# EAGLE design Led_Circle (EAGLE 7.2.0)
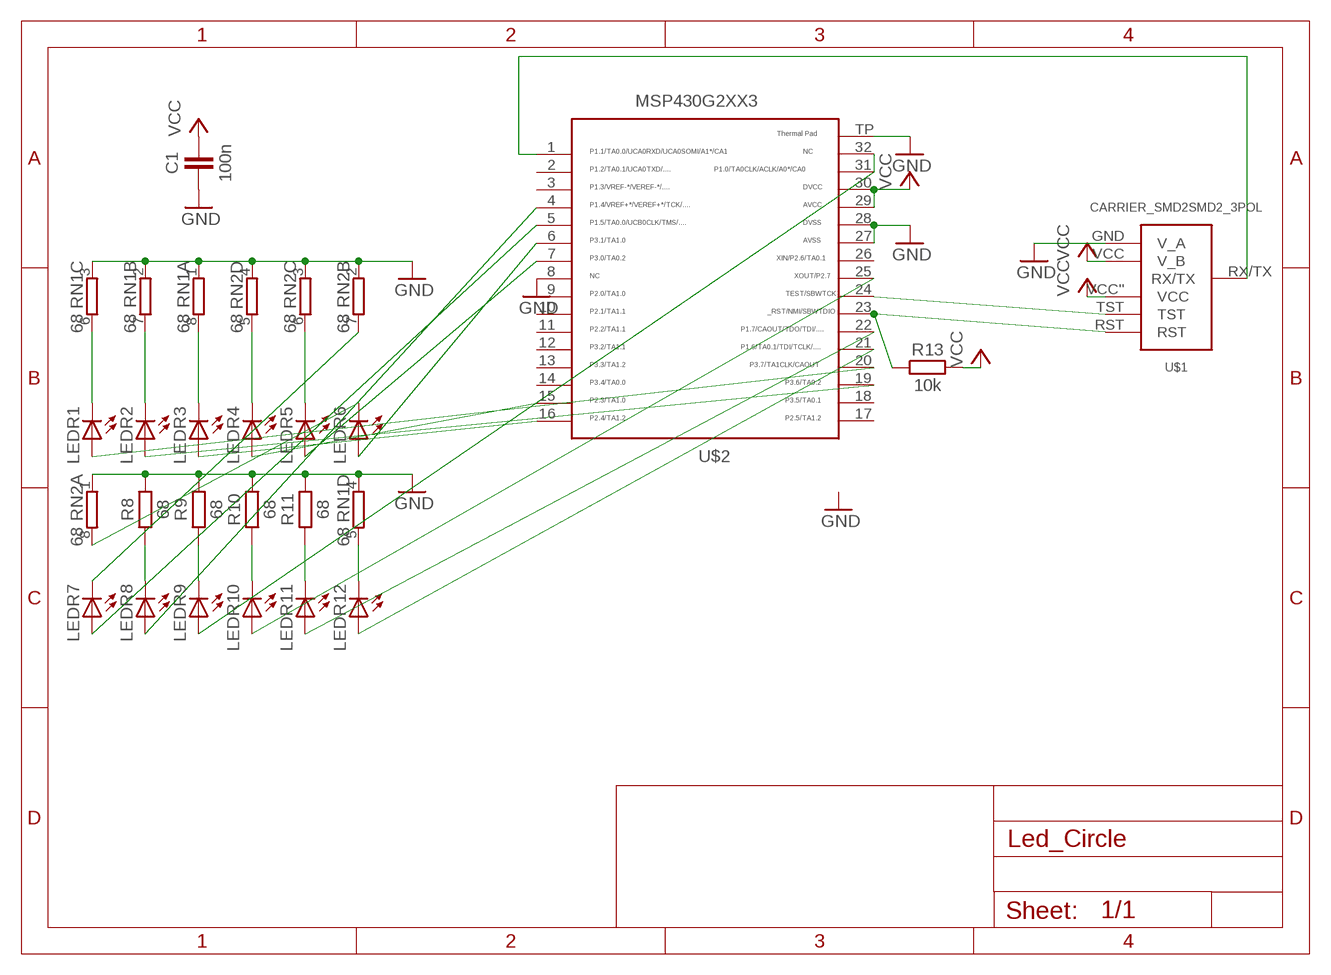
[diagram p0: schematic, sheet 1]

## Parts
C1  100n  CAPACITOR  [603]
LEDR1  LEDCHIPLED_0603  [CHIPLED_0603]
LEDR2  LEDCHIPLED_0603  [CHIPLED_0603]
LEDR3  LEDCHIPLED_0603  [CHIPLED_0603]
LEDR4  LEDCHIPLED_0603  [CHIPLED_0603]
LEDR5  LEDCHIPLED_0603  [CHIPLED_0603]
LEDR6  LEDCHIPLED_0603  [CHIPLED_0603]
LEDR7  LEDCHIPLED_0603  [CHIPLED_0603]
LEDR8  LEDCHIPLED_0603  [CHIPLED_0603]
LEDR9  LEDCHIPLED_0603  [CHIPLED_0603]
LEDR10  LEDCHIPLED_0603  [CHIPLED_0603]
LEDR11  LEDCHIPLED_0603  [CHIPLED_0603]
LEDR12  LEDCHIPLED_0603  [CHIPLED_0603]
R8  68  RESISTOR0603  [603]
R9  68  RESISTOR0603  [603]
R10  68  RESISTOR0603  [603]
R11  68  RESISTOR0603  [603]
R13  10k  RESISTOR0603  [603]
RN1  68  4R-N0603-ARC  [0603-ARC]
RN2  68  4R-N0603-ARC  [0603-ARC]
U$1  CARRIER_SMD2SMD2_3POL  [CARRIER_SMD2_3POL]
U$2  MSP430G2553  [QFN32]

## Nets
GND: C1.1 R8.2 R9.2 R10.2 R11.2 RN1.1 RN1.2 RN1.3 RN1.4 RN2.1 RN2.2 RN2.3 RN2.4 U$1.GND(V_A) U$2.8 U$2.27 U$2.28 U$2.TP
N$1: LEDR8.A U$2.4
N$2: LEDR7.C RN2.7
N$3: U$1.RX/TX U$2.1
N$4: LEDR12.C RN1.5
N$5: LEDR11.C R11.1
N$6: LEDR10.C R10.1
N$7: LEDR9.C R9.1
N$11: LEDR8.C R8.1
N$12: LEDR6.C RN2.8
N$14: LEDR5.C RN2.6
N$15: LEDR4.C RN2.5
N$16: LEDR3.C RN1.8
N$17: LEDR2.C RN1.7
N$18: LEDR1.C RN1.6
N$19: LEDR9.A U$2.31 U$2.32
N$21: LEDR10.A U$2.25
N$22: LEDR11.A U$2.22
N$23: LEDR12.A U$2.21
N$24: LEDR1.A U$2.20
N$25: LEDR2.A U$2.19
N$26: LEDR3.A U$2.16
N$27: LEDR4.A U$2.15
N$28: LEDR5.A U$2.7
N$29: LEDR6.A U$2.6
N$32: LEDR7.A U$2.5
RST: R13.1 U$1.RST U$2.23
TST: U$1.TST U$2.24
VCC: C1.2 R13.2 U$1.VCC''(VCC) U$1.VCC(V_B) U$2.29 U$2.30
Unconnected: U$2.2 U$2.3 U$2.9 U$2.10 U$2.11 U$2.12 U$2.13 U$2.14 U$2.17 U$2.18 U$2.26

## Library data of the parts
C1 = thar:CAPACITOR
LEDR1-LEDR12 = led:LED: LED OSRAM: - CHIPLED LG R971, LG N971, LY N971, LG Q971, LY Q971, LO R971, LY R971 LH N974, LH R974 LS Q976, LO Q976, LY Q976 LO Q996 - Hyper CHIPLED LW Q18S LB Q993, LB Q99A, LB R99A - SideLED LS A670, LO A670, LY A670, LG A670, LP A670 LB A673, LV A673, LT A673, LW A673 LH A674 LY A675 LS A676, LA A676, LO A676, LY A676, LW A676 LS A679, LY A679, LG A679 - Hyper Micro SIDELED® LS Y876, LA Y876, LO Y876, LY Y876 LT Y87S - SmartLED LW L88C, LW L88S LB L89C, LB L89S, LG L890 LS L89K, LO L89K, LY L89K LS L896, LA L896, LO L896, LY L896 - TOPLED LS T670, LO T670, LY T670, LG T670, LP T670 LSG T670, LSP T670, LSY T670, LOP T670, LYG T670 LG T671, LOG T671, LSG T671 LB T673, LV T673, LT T673, LW T673 LH T674 LS T676, LA T676, LO T676, LY T676, LB T676, LH T676, LSB T676, LW T676 LB T67C, LV T67C, LT T67C, LS T67K, LO T67K, LY T67K, LW E67C LS E67B, LA E67B, LO E67B, LY E67B, LB E67C, LV E67C, LT E67C LW T67C LS T679, LY T679, LG T679 LS T770, LO T770, LY T770, LG T770, LP T770 LB T773, LV T773, LT T773, LW T773 LH T774 LS E675, LA E675, LY E675, LS T675 LS T776, LA T776, LO T776, LY T776, LB T776 LHGB T686 LT T68C, LB T68C - Hyper Mini TOPLED® LB M676 - Mini TOPLED Santana® LG M470 LS M47K, LO M47K, LY M47K Source: http://www.osram.convergy.de LUXEON: - LUMILED® LXK2-PW12-R00, LXK2-PW12-S00, LXK2-PW14-U00, LXK2-PW14-V00 LXK2-PM12-R00, LXK2-PM12-S00, LXK2-PM14-U00 LXK2-PE12-Q00, LXK2-PE12-R00, LXK2-PE12-S00, LXK2-PE14-T00, LXK2-PE14-U00 LXK2-PB12-K00, LXK2-PB12-L00, LXK2-PB12-M00, LXK2-PB14-N00, LXK2-PB14-P00, LXK2-PB14-Q00 LXK2-PR12-L00, LXK2-PR12-M00, LXK2-PR14-Q00, LXK2-PR14-R00 LXK2-PD12-Q00, LXK2-PD12-R00, LXK2-PD12-S00 LXK2-PH12-R00, LXK2-PH12-S00 LXK2-PL12-P00, LXK2-PL12-Q00, LXK2-PL12-R00 Source: www.luxeon.com KINGBRIGHT: KA-3528ASYC Source: www.kingbright.com
R8-R11 R13 = thar:RESISTOR
RN1 RN2 = resistor-dil:4R-N: Array Chip Resistor Source: RS Component / Phycomp; OC_FARNELL: unknown; OC_NEWARK: unknown
U$1 = thar:CARRIER_SMD2
U$2 = thar:MSP430G2553: TEXAS INSTRUMENTS MSP430G2553IRHB32R MCU, 16BIT, MSP430, 16MHZ, QFN-32 Farnell Best.Nr.: 2325726 Herst.Bez.: MSP430G2553IRHB32R

## Board
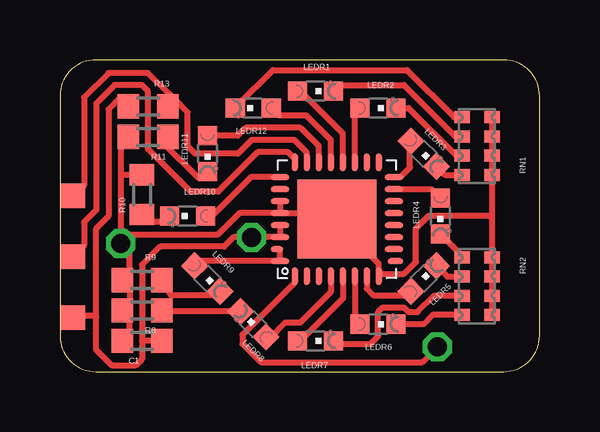
[diagram p1: board, top side]
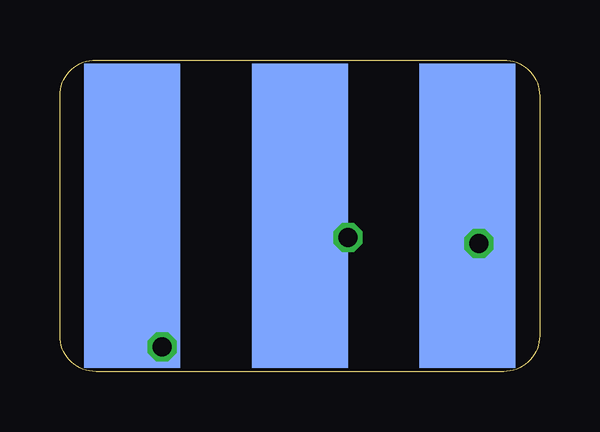
[diagram p2: board, bottom side, seen from below]

Size 20 x 13 mm. Coordinates in mm from the lower left corner, seen from the top.
Copper layers (1*16): Top 0.035mm / dielectric 1.5mm / Bottom 0.035mm
Design rules "Bilex DRU *": minimum track width 10mil, minimum drill 24mil, track to track 10mil, track to pad 10mil, pad to pad 10mil, via to via 10mil, smd to smd 10mil, copper to edge 1mil, drill to drill 8mil, minimum pad ring 10mil, minimum via ring 8mil, stop-mask expansion 4mil, vias tented up to drill 0mil, thermal gap 10mil

### Footprints (pad centres in the part's own frame; a part is rotated, then mirrored left to right if it is on the bottom)
603 = smd 0.889 x 1.016: 1 -0.826,0; 2 0.826,0
CHIPLED_0603 = smd 0.8 x 0.8: A 0,-0.75; C 0,0.75
0603-ARC = smd 0.5 x 0.65: 1 -1.2,-0.625; 2 -0.4,-0.625; 3 0.4,-0.625; 4 1.2,-0.625; 5 1.2,0.625; 6 0.4,0.625; 7 -0.4,0.625; 8 -1.2,0.625
CARRIER_SMD2_3POL = smd 4 x 12.7 bottom: GND -6.985,0; RX/TX 6.985,0; VCC 0,0 | smd 1.016 x 1.016: RST -9.461,0.826; TST -9.461,-1.714; VCC'' -9.461,-4.255
QFN32 = smd 0.762 x 0.254: 1 -2.375,1.75; 2 -2.375,1.25; 3 -2.375,0.75; 4 -2.375,0.25; 5 -2.375,-0.25; 6 -2.375,-0.75; 7 -2.375,-1.25; 8 -2.375,-1.75; 17 2.375,-1.75; 18 2.375,-1.25; 19 2.375,-0.75; 20 2.375,-0.25; 21 2.375,0.25; 22 2.375,0.75; 23 2.375,1.25; 24 2.375,1.75 | smd 0.254 x 0.635: 9 -1.75,-2.438 | smd 0.254 x 0.762: 10 -1.25,-2.375; 11 -0.75,-2.375; 12 -0.25,-2.375; 13 0.25,-2.375; 14 0.75,-2.375; 15 1.25,-2.375; 16 1.75,-2.375; 25 1.75,2.375; 26 1.25,2.375; 27 0.75,2.375; 28 0.25,2.375; 29 -0.25,2.375; 30 -0.75,2.375; 32 -1.75,2.375 | smd 0.254 x 0.508: 31 -1.25,2.5 | smd 3.302 x 3.302: TP 0,0

### Placement (x,y rotation side)
C1  3.42,1.28 0 top
LEDR1  10.66,11.69 270 top
LEDR2  13.27,11 270 top
LEDR3  15.17,9.09 225 top
LEDR4  15.87,6.49 180 top
LEDR5  15.17,3.88 315 top
LEDR6  13.27,1.98 270 top
LEDR7  10.66,1.28 270 top
LEDR8  8.06,1.98 45 top
LEDR9  6.15,3.88 225 top
LEDR10  5.33,6.49 90 top
LEDR11  6.15,9.09 180 top
LEDR12  8.06,11 90 top
R8  3.42,2.55 180 top
R9  3.42,3.82 180 top
R10  3.42,7.38 90 top
R11  3.68,9.79 180 top
R13  3.68,11.06 180 top
RN1  17.39,9.41 90 top
RN2  17.39,3.57 90 top
U$1  10,6.5 0 top
U$2  11.55,6.36 90 top

### Tracks (layer width: path | path; a pad name or v marks a point on that pad's centre or on a via)
GND  (via drill 0.8)
  Top 0.254: U$2.28 10.79,6.61 U$2.TP 12.31,5.73 12.19,5.6 13.3,4.48 U$2.8 13.43,4.07 14.34,4.07 14.85,4.58 14.85,5.98 15.36,6.49 17.9,6.49 | 18.03,6.49 18.03,5.03 18.02,5.02 RN2.4 RN2.3 RN2.2 RN2.1 | 18.03,6.49 17.9,6.49 | 2.91,5.73 2.79,5.73 2.53,5.98 2.53,8.14 | 2.91,5.73 6.6,5.73 7.48,6.61 U$2.28 | R11.2 2.84,10.03 2.78,10.03 2.53,9.79 2.53,8.14 | U$2.27 U$2.28 | RN1.4 RN1.3 RN1.2 RN1.1 18.02,6.5 | 18.02,6.5 18.03,6.49 | 18.02,6.5 17.89,6.5 17.9,6.49 | R10.2 2.6,8.2 2.53,8.14 | 2.91,5.34 2.91,3.57 2.79,3.57 2.79,3.44 2.91,3.44 2.91,2.3 | 2.91,5.34 2.91,5.73 | v2.53,5.34 2.91,5.34 | 2.91,2.3 R8.2 | C1.1 2.91,1.28 2.91,2.3
  Top 0.406: R9.2 2.79,3.57
  Bottom 0.254: 2,6.5 2.41,6.09 v2.53,5.34 3.02,5.57 U$1.GND
N$1
  Top 0.254: LEDR8.A 8.8,1.45 9.39,2.04 10.03,2.04 11.3,3.32 U$2.4
N$2
  Top 0.254: LEDR7.C 11.42,1.28 11.55,1.15 12.95,1.15 13.27,1.47 13.27,2.49 13.46,2.68 14.34,2.68 14.54,2.49 14.92,2.49 15.6,3.17 RN2.7
N$3  (via drill 0.8)
  Top 0.254: U$2.1 9.8,3.72 7.61,1.53 7.61,1.15 8.38,0.39 15.11,0.39 v15.74,1.03
  Bottom 0.254: U$1.RX/TX 16.98,2.27 v15.74,1.03
N$4
  Top 0.254: LEDR12.C 7.41,11.11 8.88,12.58 14.47,12.58 16.45,10.61 RN1.5
N$5
  Top 0.254: LEDR11.C 6.22,8.14 6.17,8.09 5.76,8.09 4.31,9.54 4.31,10.04 4.38,9.98 4.57,9.98 R11.1
N$6
  Top 0.254: LEDR10.C 4.58,6.37 4.44,6.23 3.74,6.23 R10.1
N$7
  Top 0.254: LEDR9.C 6.68,3.14 6.6,3.06 6.6,3.18 4.63,3.18 R9.1
N$11
  Top 0.254: LEDR8.C 4.46,2.51 R8.1
N$12
  Top 0.254: RN2.8 15.56,2.37 15.17,1.98 LEDR6.C
N$14
  Top 0.254: LEDR5.C 16.15,3.97 RN2.6
N$15
  Top 0.254: 15.87,5.85 LEDR4.C 16.77,4.84 RN2.5
N$16
  Top 0.254: LEDR3.C 16.05,8.21 RN1.8
N$17
  Top 0.254: LEDR2.C 14.54,11 16.52,9.01 RN1.7
N$18
  Top 0.254: LEDR1.C 11.54,11.81 11.55,11.95 14.34,11.95 16.48,9.81 RN1.6
N$19
  Top 0.254: U$2.31 9.18,5.11 U$2.32 5.82,4.61 LEDR9.A 5.66,4.45
N$21
  Top 0.254: U$2.25 7.97,8.11 6.34,6.49 LEDR10.A
N$22
  Top 0.254: LEDR11.A 7.41,9.84 7.74,10.17 10.03,10.17 10.8,9.4 U$2.22
N$23
  Top 0.254: U$2.21 11.3,9.66 10.28,10.68 9.13,10.68 LEDR12.A
N$24
  Top 0.254: U$2.20 11.8,9.92 10.03,11.69 LEDR1.A
N$25
  Top 0.254: U$2.19 12.3,11.04 LEDR2.A
N$26
  Top 0.254: U$2.16 14.19,8.11 14.6,8.52 14.6,9.58 LEDR3.A
N$27
  Top 0.254: U$2.15 15.5,7.61 LEDR4.A
N$28
  Top 0.254: U$2.7 12.8,3.46 13.07,3.18 14.47,3.18 LEDR5.A
N$29
  Top 0.254: U$2.6 12.3,2.07 LEDR6.A
N$32
  Top 0.254: U$2.5 11.81,3.05 10.03,1.28 LEDR7.A
RST
  Top 0.254: U$2.23 10.3,9.13 9.77,9.66 8,9.66 7.42,9.09 5.64,9.09 5.33,9.41 5.33,10.8 4.82,11.31 4.76,11.38 | 4.5,11.63 R13.1 4.5,11.38 4.76,11.38 | 4.76,11.38 4.5,11.63 | 4.5,11.63 3.68,12.46 2.03,12.46 1.01,11.44 1.01,7.76 0.58,7.33 U$1.RST
TST
  Top 0.254: U$2.24 9.8,8.87 9.52,9.15 8.25,9.15 6.6,7.5 5.45,7.5 3.68,9.28 3.68,11.69 3.42,11.95 2.28,11.95 1.52,11.19 1.52,6.74 1.01,6.23 1.01,5.26 U$1.TST
VCC  (via drill 0.8)
  Top 0.254: U$2.29 U$2.30 v8,5.61 | R13.2 2.79,11.44 2.53,11.44 2.03,10.93 2.03,6.49 1.52,5.98 1.52,2.3 | 1.52,2.3 1.52,0.9 2.15,0.26 3.17,0.26 3.42,0.52 3.42,1.28 | U$1.VCC'' 0.68,2.25 0.68,2.35 1.47,2.35 1.52,2.3 | 3.42,1.28 3.42,4.45 4.18,5.22 6.85,5.22 7.25,5.61 v8,5.61 | C1.2 3.42,1.28 | v8,5.6 v8,5.61
  Bottom 0.254: 10,3.41 U$1.VCC 8.9,6.5 v8,5.6